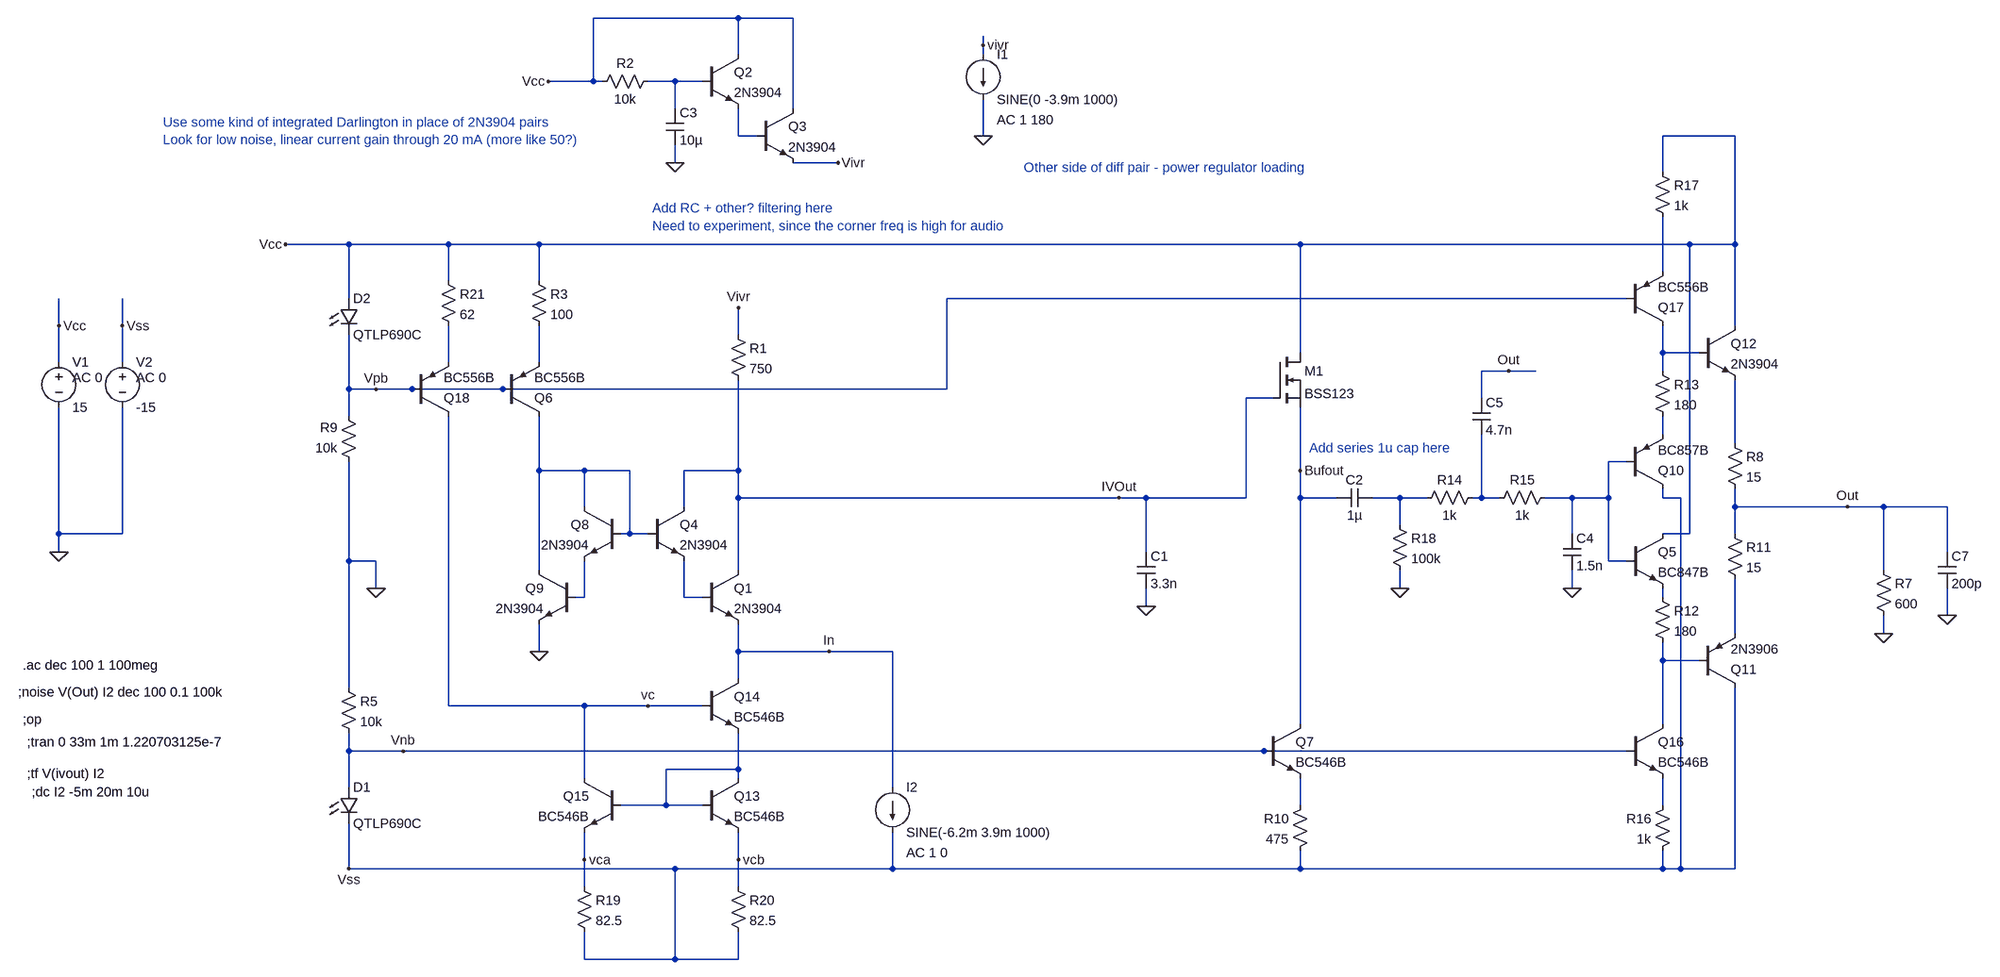
[diagram p0: schematic iv_v2_rl.asc]
iv_v2_rl.asc, the LTspice schematic file:
Version 4
SHEET 1 2936 1352
WIRE 688 -992 432 -992
WIRE 784 -992 688 -992
WIRE 1120 -944 1120 -960
WIRE 688 -928 688 -992
WIRE 1120 -928 1120 -944
WIRE 432 -880 432 -992
WIRE 432 -880 352 -880
WIRE 448 -880 432 -880
WIRE 576 -880 528 -880
WIRE 624 -880 576 -880
WIRE 576 -832 576 -880
WIRE 784 -832 784 -992
WIRE 688 -784 688 -832
WIRE 720 -784 688 -784
WIRE 1120 -784 1120 -848
WIRE 2448 -784 2320 -784
WIRE 576 -736 576 -768
WIRE 864 -736 784 -736
WIRE 2320 -720 2320 -784
WIRE 0 -592 -112 -592
WIRE 176 -592 0 -592
WIRE 336 -592 176 -592
WIRE 1680 -592 336 -592
WIRE 2368 -592 1680 -592
WIRE 2448 -592 2448 -784
WIRE 2448 -592 2368 -592
WIRE 2320 -544 2320 -640
WIRE 176 -528 176 -592
WIRE 336 -528 336 -592
WIRE 0 -496 0 -592
WIRE 2256 -496 1056 -496
WIRE -512 -448 -512 -496
WIRE -400 -448 -400 -496
WIRE 2448 -448 2448 -592
WIRE 688 -432 688 -480
WIRE 1680 -400 1680 -592
WIRE 2320 -400 2320 -448
WIRE 2384 -400 2320 -400
WIRE -512 -384 -512 -448
WIRE -400 -384 -400 -448
WIRE 176 -384 176 -448
WIRE 336 -384 336 -448
WIRE 2048 -368 2000 -368
WIRE 2096 -368 2048 -368
WIRE 2320 -368 2320 -400
WIRE 0 -336 0 -432
WIRE 48 -336 0 -336
WIRE 112 -336 48 -336
WIRE 272 -336 112 -336
WIRE 1056 -336 1056 -496
WIRE 1056 -336 272 -336
WIRE 1632 -320 1584 -320
WIRE 2000 -320 2000 -368
WIRE 0 -288 0 -336
WIRE 2320 -256 2320 -288
WIRE 2448 -240 2448 -352
WIRE 2256 -208 2224 -208
WIRE 336 -192 336 -288
WIRE 416 -192 336 -192
WIRE 496 -192 416 -192
WIRE 688 -192 688 -352
WIRE 688 -192 592 -192
WIRE 1680 -192 1680 -304
WIRE 688 -144 688 -192
WIRE 1360 -144 688 -144
WIRE 1408 -144 1360 -144
WIRE 1584 -144 1584 -320
WIRE 1584 -144 1408 -144
WIRE 1680 -144 1680 -192
WIRE 1744 -144 1680 -144
WIRE 1856 -144 1808 -144
WIRE 1904 -144 1856 -144
WIRE 2000 -144 2000 -256
WIRE 2000 -144 1984 -144
WIRE 2032 -144 2000 -144
WIRE 2160 -144 2112 -144
WIRE 2224 -144 2224 -208
WIRE 2224 -144 2160 -144
WIRE 2320 -144 2320 -160
WIRE 2352 -144 2320 -144
WIRE 416 -128 416 -192
WIRE 592 -128 592 -192
WIRE 2448 -128 2448 -160
WIRE 2688 -128 2448 -128
WIRE 2752 -128 2688 -128
WIRE 2864 -128 2752 -128
WIRE 1856 -96 1856 -144
WIRE -512 -80 -512 -304
WIRE -400 -80 -400 -304
WIRE -400 -80 -512 -80
WIRE 496 -80 496 -192
WIRE 496 -80 480 -80
WIRE 528 -80 496 -80
WIRE 2160 -80 2160 -144
WIRE 2368 -80 2368 -592
WIRE 2368 -80 2320 -80
WIRE 2448 -80 2448 -128
WIRE -512 -48 -512 -80
WIRE 1408 -48 1408 -144
WIRE 2864 -48 2864 -128
WIRE 0 -32 0 -208
WIRE 48 -32 0 -32
WIRE 2224 -32 2224 -144
WIRE 2256 -32 2224 -32
WIRE 336 -16 336 -192
WIRE 688 -16 688 -144
WIRE 2752 -16 2752 -128
WIRE 48 16 48 -32
WIRE 1856 16 1856 -16
WIRE 2160 16 2160 -16
WIRE 416 32 416 -32
WIRE 416 32 400 32
WIRE 592 32 592 -32
WIRE 624 32 592 32
WIRE 2320 32 2320 16
WIRE 1408 48 1408 16
WIRE 2864 64 2864 16
WIRE 2448 96 2448 0
WIRE 2752 96 2752 64
WIRE 336 128 336 80
WIRE 688 128 688 80
WIRE 848 128 688 128
WIRE 960 128 848 128
WIRE 2320 144 2320 112
WIRE 2384 144 2320 144
WIRE 688 176 688 128
WIRE 0 192 0 -32
WIRE 176 224 176 -288
WIRE 416 224 176 224
WIRE 528 224 416 224
WIRE 624 224 528 224
WIRE 1680 256 1680 -144
WIRE 2320 256 2320 144
WIRE 0 304 0 272
WIRE 96 304 0 304
WIRE 1616 304 96 304
WIRE 2256 304 1616 304
WIRE 688 336 688 272
WIRE 688 336 560 336
WIRE 416 352 416 224
WIRE 688 352 688 336
WIRE 0 368 0 304
WIRE 960 368 960 128
WIRE 560 400 560 336
WIRE 560 400 480 400
WIRE 624 400 560 400
WIRE 1680 400 1680 352
WIRE 2320 400 2320 352
WIRE 416 496 416 448
WIRE 688 496 688 448
WIRE 0 512 0 432
WIRE 576 512 0 512
WIRE 960 512 960 448
WIRE 960 512 576 512
WIRE 1680 512 1680 480
WIRE 1680 512 960 512
WIRE 2320 512 2320 480
WIRE 2320 512 1680 512
WIRE 2352 512 2352 -144
WIRE 2352 512 2320 512
WIRE 2448 512 2448 192
WIRE 2448 512 2352 512
WIRE 416 544 416 496
WIRE 688 544 688 496
WIRE 416 672 416 624
WIRE 576 672 576 512
WIRE 576 672 416 672
WIRE 688 672 688 624
WIRE 688 672 576 672
FLAG -512 -48 0
FLAG -512 -448 Vcc
FLAG -400 -448 Vss
FLAG 1360 -144 IVOut
FLAG 848 128 In
FLAG -112 -592 Vcc
FLAG 0 512 Vss
FLAG 336 128 0
FLAG 2752 96 0
FLAG 2688 -128 Out
FLAG 2160 16 0
FLAG 2048 -368 Out
FLAG 2864 64 0
FLAG 1408 48 0
FLAG 1680 -192 Bufout
FLAG 1856 16 0
FLAG 96 304 Vnb
FLAG 48 16 0
FLAG 416 496 vca
FLAG 688 496 vcb
FLAG 528 224 vc
FLAG 48 -336 Vpb
FLAG 688 -480 Vivr
FLAG 576 -736 0
FLAG 352 -880 Vcc
FLAG 864 -736 Vivr
FLAG 1120 -784 0
FLAG 1120 -944 vivr
SYMBOL voltage -512 -400 R0
WINDOW 123 24 44 Left 2
WINDOW 39 0 0 Left 2
SYMATTR Value2 AC 0
SYMATTR InstName V1
SYMATTR Value 15
SYMBOL voltage -400 -400 R0
WINDOW 123 24 44 Left 2
WINDOW 39 0 0 Left 2
SYMATTR Value2 AC 0
SYMATTR InstName V2
SYMATTR Value -15
SYMBOL npn 624 -16 R0
SYMATTR InstName Q1
SYMATTR Value 2N3904
SYMBOL current 960 368 R0
WINDOW 123 24 116 Left 2
WINDOW 39 0 0 Left 2
SYMATTR Value2 AC 1 0
SYMATTR InstName I2
SYMATTR Value SINE(-6.2m 3.9m 1000)
SYMBOL res 672 -448 R0
SYMATTR InstName R1
SYMATTR Value 750
SYMBOL nmos 1632 -400 R0
SYMATTR InstName M1
SYMATTR Value BSS123
SYMBOL npn 1616 256 R0
SYMATTR InstName Q7
SYMATTR Value BC546B
SYMBOL res 1696 384 M0
SYMATTR InstName R10
SYMATTR Value 475
SYMBOL npn 528 -128 R0
SYMATTR InstName Q4
SYMATTR Value 2N3904
SYMBOL npn 480 -128 M0
SYMATTR InstName Q8
SYMATTR Value 2N3904
SYMBOL npn 400 -16 M0
SYMATTR InstName Q9
SYMATTR Value 2N3904
SYMBOL res 2736 -32 R0
SYMATTR InstName R7
SYMATTR Value 600
SYMBOL npn 2256 -80 R0
SYMATTR InstName Q5
SYMATTR Value BC847B
SYMBOL pnp 2256 -160 M180
SYMATTR InstName Q10
SYMATTR Value BC857B
SYMBOL pnp 2384 192 M180
SYMATTR InstName Q11
SYMATTR Value 2N3906
SYMBOL npn 2384 -448 R0
SYMATTR InstName Q12
SYMATTR Value 2N3904
SYMBOL res 2432 -256 R0
SYMATTR InstName R8
SYMATTR Value 15
SYMBOL res 2432 -96 R0
SYMATTR InstName R11
SYMATTR Value 15
SYMBOL res 2304 16 R0
SYMATTR InstName R12
SYMATTR Value 180
SYMBOL res 2304 -384 R0
SYMATTR InstName R13
SYMATTR Value 180
SYMBOL res 2000 -160 R90
WINDOW 0 0 56 VBottom 2
WINDOW 3 32 56 VTop 2
SYMATTR InstName R14
SYMATTR Value 1k
SYMBOL res 2128 -160 R90
WINDOW 0 0 56 VBottom 2
WINDOW 3 32 56 VTop 2
SYMATTR InstName R15
SYMATTR Value 1k
SYMBOL cap 2144 -80 R0
SYMATTR InstName C4
SYMATTR Value 1.5n
SYMBOL cap 1984 -320 R0
SYMATTR InstName C5
SYMATTR Value 4.7n
SYMBOL cap 2848 -48 R0
SYMATTR InstName C7
SYMATTR Value 200p
SYMBOL cap 1392 -48 R0
SYMATTR InstName C1
SYMATTR Value 3.3n
SYMBOL pnp 272 -288 M180
SYMATTR InstName Q6
SYMATTR Value BC556B
SYMBOL res 320 -544 R0
SYMATTR InstName R3
SYMATTR Value 100
SYMBOL npn 624 352 R0
SYMATTR InstName Q13
SYMATTR Value BC546B
SYMBOL npn 624 176 R0
SYMATTR InstName Q14
SYMATTR Value BC546B
SYMBOL npn 480 352 M0
SYMATTR InstName Q15
SYMATTR Value BC546B
SYMBOL npn 2256 256 R0
SYMATTR InstName Q16
SYMATTR Value BC546B
SYMBOL res 2336 384 M0
SYMATTR InstName R16
SYMATTR Value 1k
SYMBOL pnp 2256 -448 M180
SYMATTR InstName Q17
SYMATTR Value BC556B
SYMBOL res 2304 -736 R0
SYMATTR InstName R17
SYMATTR Value 1k
SYMBOL res 1840 -112 R0
SYMATTR InstName R18
SYMATTR Value 100k
SYMBOL cap 1744 -160 M90
WINDOW 0 0 32 VBottom 2
WINDOW 3 32 32 VTop 2
SYMATTR InstName C2
SYMATTR Value 1µ
SYMBOL res 400 528 R0
SYMATTR InstName R19
SYMATTR Value 82.5
SYMBOL res 672 528 R0
SYMATTR InstName R20
SYMATTR Value 82.5
SYMBOL LED -16 368 R0
SYMATTR InstName D1
SYMATTR Value QTLP690C
SYMATTR Description Zener Diode
SYMATTR Type zener
SYMBOL res -16 176 R0
SYMATTR InstName R5
SYMATTR Value 10k
SYMBOL LED -16 -496 R0
SYMATTR InstName D2
SYMATTR Value QTLP690C
SYMATTR Description Zener Diode
SYMATTR Type zener
SYMBOL res 16 -192 R180
WINDOW 0 36 76 Left 2
WINDOW 3 36 40 Left 2
SYMATTR InstName R9
SYMATTR Value 10k
SYMBOL pnp 112 -288 M180
SYMATTR InstName Q18
SYMATTR Value BC556B
SYMBOL res 160 -544 R0
SYMATTR InstName R21
SYMATTR Value 62
SYMBOL npn 624 -928 R0
SYMATTR InstName Q2
SYMATTR Value 2N3904
SYMBOL res 544 -896 R90
WINDOW 0 0 56 VBottom 2
WINDOW 3 32 56 VTop 2
SYMATTR InstName R2
SYMATTR Value 10k
SYMBOL cap 560 -832 R0
SYMATTR InstName C3
SYMATTR Value 10µ
SYMBOL npn 720 -832 R0
SYMATTR InstName Q3
SYMATTR Value 2N3904
SYMBOL current 1120 -928 R0
WINDOW 123 24 116 Left 2
WINDOW 39 0 0 Left 2
SYMATTR Value2 AC 1 180
SYMATTR InstName I1
SYMATTR Value SINE(0 -3.9m 1000)
TEXT -568 288 Left 2 !;tran 0 33m 1m 1.220703125e-7
TEXT -576 248 Left 2 !;op
TEXT -584 200 Left 2 !;noise V(Out) I2 dec 100 0.1 100k
TEXT -576 152 Left 2 !.ac dec 100 1 100meg
TEXT -568 344 Left 2 !;tf V(ivout) I2
TEXT -560 376 Left 2 !;dc I2 -5m 20m 10u
TEXT 536 -656 Left 2 ;Add RC + other? filtering here\nNeed to experiment, since the corner freq is high for audio
TEXT 1696 -232 Left 2 ;Add series 1u cap here
TEXT 1192 -728 Left 2 ;Other side of diff pair - power regulator loading
TEXT -328 -808 Left 2 ;Use some kind of integrated Darlington in place of 2N3904 pairs\nLook for low noise, linear current gain through 20 mA (more like 50?)

The netlist it stands for:
* iv_v2_rl.asc
V1 Vcc 0 15 AC 0
V2 Vss 0 -15 AC 0
Q1 IVOut N014 In 0 2N3904
I2 In Vss SINE(-6.2m 3.9m 1000) AC 1 0
R1 Vivr IVOut 750
M1 Vcc IVOut Bufout Bufout BSS123
Q7 Bufout Vnb N019 0 BC546B
R10 N019 Vss 475
Q4 IVOut N010 N014 0 2N3904
Q8 N010 N010 N013 0 2N3904
Q9 N010 N013 0 0 2N3904
R7 Out 0 600
Q5 Vcc N009 N015 0 BC847B
Q10 Vss N009 N007 0 BC857B
Q11 Vss N017 N016 0 2N3906
Q12 Vcc N004 N008 0 2N3904
R8 N008 Out 15
R11 Out N016 15
R12 N015 N017 180
R13 N004 N007 180
R14 N012 N011 1k
R15 N009 N012 1k
C4 N009 0 1.5n
C5 Out N012 4.7n
C7 Out 0 200p
C1 IVOut 0 3.3n
Q6 N010 Vpb N006 0 BC556B
R3 Vcc N006 100
Q13 N018 N018 vcb 0 BC546B
Q14 In vc N018 0 BC546B
Q15 vc N018 vca 0 BC546B
Q16 N017 Vnb N020 0 BC546B
R16 N020 Vss 1k
Q17 N004 Vpb N003 0 BC556B
R17 Vcc N003 1k
R18 N011 0 100k
C2 Bufout N011 1µ
R19 vca Vss 82.5
R20 vcb Vss 82.5
D1 Vnb Vss QTLP690C
R5 0 Vnb 10k
D2 Vcc Vpb QTLP690C
R9 0 Vpb 10k
Q18 vc Vpb N005 0 BC556B
R21 Vcc N005 62
Q2 Vcc N001 N002 0 2N3904
R2 N001 Vcc 10k
C3 N001 0 10µ
Q3 Vcc N002 Vivr 0 2N3904
I1 Vivr 0 SINE(0 -3.9m 1000) AC 1 180
.model D D
.lib standard.dio
.model NPN NPN
.model PNP PNP
.lib standard.bjt
.model NMOS NMOS
.model PMOS PMOS
.lib standard.mos
;tran 0 33m 1m 1.220703125e-7
;op
;noise V(Out) I2 dec 100 0.1 100k
.ac dec 100 1 100meg
;tf V(ivout) I2
;dc I2 -5m 20m 10u
* Add RC + other? filtering here
* Need to experiment, since the corner freq is high for audio
* Add series 1u cap here
* Other side of diff pair - power regulator loading
* Use some kind of integrated Darlington in place of 2N3904 pairs
* Look for low noise, linear current gain through 20 mA (more like 50?)
.backanno
.end